# Altium schematic sheet Power.SchDoc
size A4
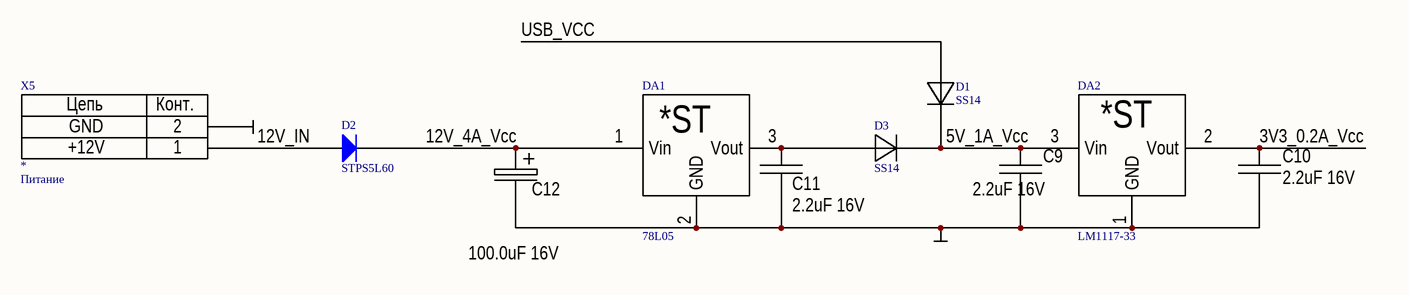
[diagram p0: Power.SchDoc]

## Parts
C9  2.2uF 16V  [0805_CAP]
C10  2.2uF 16V  [0805_CAP]
C11  2.2uF 16V  [0805_CAP]
C12  100.0uF 16V  [CAP_P_8mm_3.5mm]
D1  SS14  [SMA_diode]
D2  STPS5L60  [SMC]
D3  SS14  [SMA_diode]
DA1  78L05  [to-220ab]
DA2  LM1117-33  [dpack]
X5  *  Destiny: Питание  [2pin_5.08]

## Nets
GND: C9.1 C10.1 C11.1 C12.2 DA1.2(GND) DA2.1(GND) X5.2
3V3_0.2A_Vcc: C10.2 DA2.2(Vout)
5V_1A_Vcc: C9.2 D1.2 D3.2 DA2.3(Vin)
12V_4A_Vcc: C12.1 D2.2(K) DA1.1(Vin)
12V_IN: D2.1(A) X5.1
USB_VCC: D1.1
NetC11_2: C11.2 D3.1 DA1.3(Vout)

## Notes on the sheet
- (in symbol 2pin_conn) Цепь; Конт.
- (in symbol 78L05) *ST
- (in symbol LM1117) *ST

## Library data of the parts
C9-C11 = Cap_np: Value: 2.2uF 16V
C12 = Cap_p: Group: Passive; Value: 100.0uF 16V
D1 D3 = Diode: Value: SS14
D2 = Diode: Default Diode; Published: 8-Jun-2000; LatestRevisionDate: 17-Jul-2002; LatestRevisionNote: Re-released for DXP Platform.; PackageVersion: Sep-1996; PackageReference: SMC; Publisher: Altium Limited; PackageDescription: DO-214-AB/SMC; 2 C-Bend Leads; Body 7.9 x 5.9 mm, inc. leads (LxW); Code_JEDEC: DO-214-AB
DA2 = LM1117: Value: LM1117-33
X5 = 2pin_conn: PinName2: GND; PinName1: +12V; Value: *
DA1 = 78L05: Value: 78L05